# EAGLE design secs_q84 v2 (EAGLE 9.6.2)
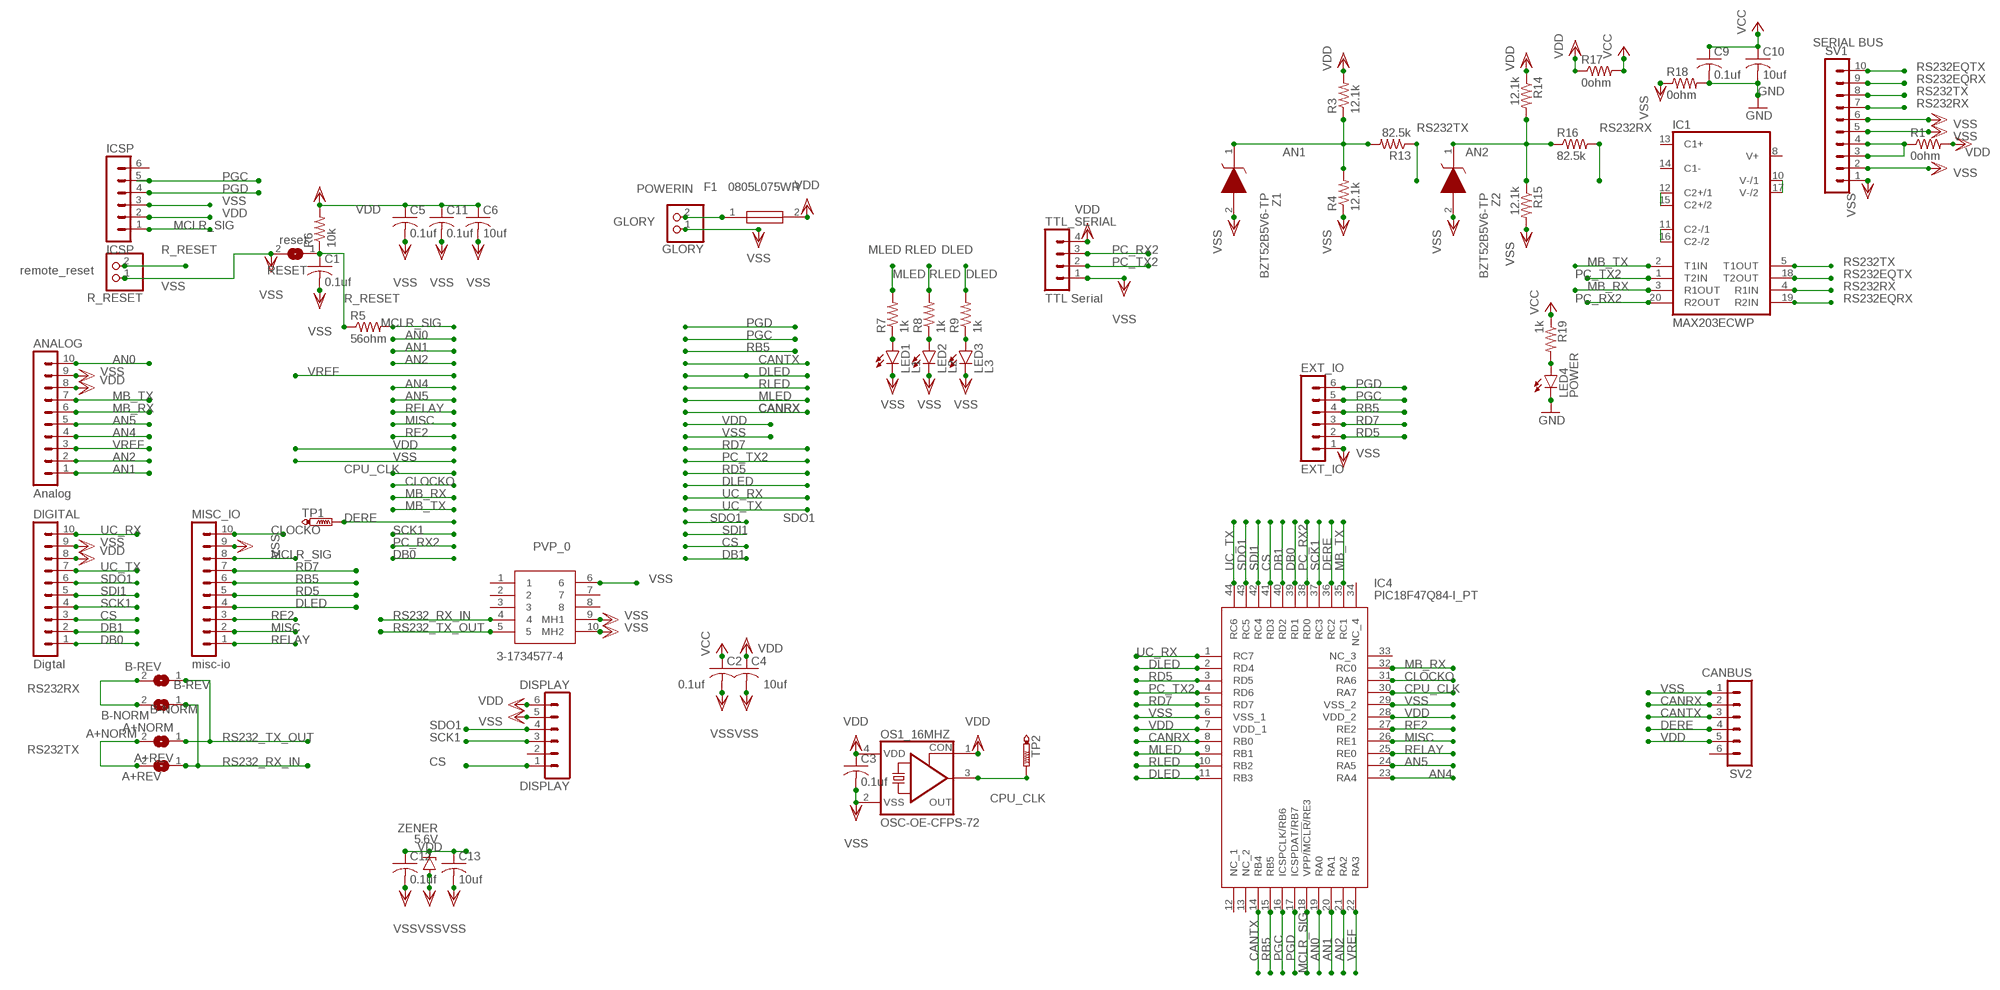
[diagram p0: schematic, sheet 1]

## Parts
A+NORM  A+NORM  SJ  [SJ]
A+REV  A+REV  SJ  [SJ]
ANALOG  Analog  MA10-1  [MA10-1]
B-NORM  B-NORM  SJ  [SJ]
B-REV  B-REV  SJ  [SJ]
C1  0.1uf  C-USC0805  [C0805]
C2  0.1uf  C-USC0805  [C0805]
C3  0.1uf  C-USC0805  [C0805]
C4  10uf  C-USC0805  [C0805]
C5  0.1uf  C-USC0805  [C0805]
C6  10uf  C-USC0805  [C0805]
C9  0.1uf  C-USC0805  [C0805]
C10  10uf  C-USC0805  [C0805]
C11  0.1uf  C-USC0805  [C0805]
C12  0.1uf  C-USC0805  [C0805]
C13  10uf  C-USC0805  [C0805]
DIGITAL  Digtal  MA10-1  [MA10-1]
DISPLAY  DISPLAY  MA06-1  [MA06-1]
EXT_IO  EXT_IO  MA06-1  [MA06-1]
F1  0805L075WR  [FUSC2114X125N]
GLORY  GLORY  PINHD-1X2  [1X02]
IC1  MAX203ECWP  [SO20L]
IC4  PIC18F47Q84-I_PT  [QFP80P1200X1200X120-44N]
ICSP  ICSP  MA06-1  [MA06-1]
LED1  L1  LEDCHIPLED_0805  [CHIPLED_0805]
LED2  L2  LEDCHIPLED_0805  [CHIPLED_0805]
LED3  L3  LEDCHIPLED_0805  [CHIPLED_0805]
LED4  POWER  LEDCHIP-LED0603  [CHIP-LED0603]
MISC_IO  misc-io  MA10-1  [MA10-1]
OS1_16MHZ  OSC-OE-CFPS-72  [7.2X5.2-4-PAD]
PVP_0  3-1734577-4  [317345774]
R1  0ohm  R-US_R0805  [R0805]
R3  12.1k  R-US_R0805  [R0805]
R4  12.1k  R-US_R0805  [R0805]
R5  56ohm  R-US_R0805  [R0805]
R6  10k  R-US_R0805  [R0805]
R7  1k  R-US_R0805  [R0805]
R8  1k  R-US_R0805  [R0805]
R9  1k  R-US_R0805  [R0805]
R13  82.5k  R-US_R0805  [R0805]
R14  12.1k  R-US_R0805  [R0805]
R15  12.1k  R-US_R0805  [R0805]
R16  82.5k  R-US_R0805  [R0805]
R17  0ohm  R-US_R0805  [R0805]
R18  0ohm  R-US_R0805  [R0805]
R19  1k  R-US_R0805  [R0805]
R_RESET  remote_reset  PINHD-1X2  [1X02]
RESET  reset  SJ  [SJ]
SV1  SERIAL BUS  MA10-1  [MA10-1]
SV2  CANBUS  MA06-1  [MA06-1]
TP1  PTR1PAD1-13  [P1-13]
TP2  PTR1PAD1-13  [P1-13]
TTL_SERIAL  TTL Serial  MA04-1  [MA04-1]
Z1  BZT52B5V6-TP  [SOD3716X135N]
Z2  BZT52B5V6-TP  [SOD3716X135N]
ZENER  5.6V  ZENER-DIODESMB  [SMB]

## Nets
AN0: ANALOG.10 IC4.19(RA0)
AN1: ANALOG.1 IC4.20(RA1) R3.1 R4.2 R13.2 Z1.1(K)
AN2: ANALOG.2 IC4.21(RA2) R14.2 R15.1 R16.1 Z2.1(K)
AN4: ANALOG.4 IC4.23(RA4)
AN5: ANALOG.5 IC4.24(RA5)
CANRX: IC4.8(RB0) SV2.2
CANTX: IC4.14(RB4) SV2.3
CLOCKO: IC4.31(RA6) MISC_IO.10
CPU_CLK: IC4.30(RA7) OS1_16MHZ.3(OUT) TP2.TP
CS: DIGITAL.3 DISPLAY.1 IC4.41(RD3)
DB0: DIGITAL.1 IC4.39(RD1)
DB1: DIGITAL.2 IC4.40(RD2)
DERE: IC4.36(RC2) SV2.4 TP1.TP
DLED: IC4.2(RD4) IC4.11(RB3) MISC_IO.4 R9.2
DPOWER [icurrent]: R1.1 SV1.3 SV1.4
GND [icurrent]: C9.2 C10.2 LED4.C R18.2
MB_RX: ANALOG.6 IC1.3(R1OUT) IC4.32(RC0)
MB_TX: ANALOG.7 IC1.2(T1IN) IC4.35(RC1)
MCLR_SIG: IC4.18(VPP/!MCLR!/RE3) ICSP.1 MISC_IO.8 R5.2
MISC: IC4.26(RE1) MISC_IO.2
MLED: IC4.9(RB1) R7.2
N$1: IC1.10(V-/1) IC1.17(V-/2)
N$2: IC1.12(C2+/1) IC1.15(C2+/2)
N$3: LED4.A R19.2
N$4: LED1.A R7.1
N$5: LED2.A R8.1
N$6: LED3.A R9.1
N$7: IC1.11(C2-/1) IC1.16(C2-/2)
PC_RX2: IC1.20(R2OUT) IC4.38(RD0) TTL_SERIAL.3
PC_TX2: IC1.1(T2IN) IC4.4(RD6) TTL_SERIAL.2
PGC: EXT_IO.5 IC4.16(ICSPCLK/RB6) ICSP.5
PGD: EXT_IO.6 IC4.17(ICSPDAT/RB7) ICSP.4
POWERIN [icurrent]: F1.1 GLORY.2
R_RESET: C1.1 R5.1 R6.1 R_RESET.2 RESET.1
RB5: EXT_IO.4 IC4.15(RB5) MISC_IO.6
RD5: EXT_IO.2 IC4.3(RD5) MISC_IO.5
RD7: EXT_IO.3 IC4.5(RD7) MISC_IO.7
RE2: IC4.27(RE2) MISC_IO.3
RELAY: IC4.25(RE0) MISC_IO.1
RLED: IC4.10(RB2) R8.2
RS232_RX_IN: A+REV.1 B-NORM.1 PVP_0.4
RS232_TX_OUT: A+NORM.1 B-REV.1 PVP_0.5
RS232EQRX: IC1.19(R2IN) SV1.9
RS232EQTX: IC1.18(T2OUT) SV1.10
RS232RX: B-NORM.2 B-REV.2 IC1.4(R1IN) R16.2 SV1.7
RS232TX: A+NORM.2 A+REV.2 IC1.5(T1OUT) R13.1 SV1.8
SCK1: DIGITAL.4 DISPLAY.3 IC4.37(RC3)
SDI1: DIGITAL.5 IC4.42(RC4)
SDO1: DIGITAL.6 DISPLAY.4 IC4.43(RC5)
UC_RX: DIGITAL.10 IC4.1(RC7)
UC_TX: DIGITAL.7 IC4.44(RC6)
VCC [icurrent]: C2.1 C9.1 C10.1 R17.2 R19.1
VDD [icurrent]: ANALOG.8 C3.1 C4.1 C5.1 C6.1 C11.1 C12.1 C13.1 DIGITAL.8 DISPLAY.6 F1.2 IC4.7(VDD_1) IC4.28(VDD_2) ICSP.2 OS1_16MHZ.1(CON) OS1_16MHZ.4(VDD) R1.2 R3.2 R6.2 R14.1 R17.1 SV2.5 TTL_SERIAL.4 ZENER.C
VREF: ANALOG.3 IC4.22(RA3)
VSS [icurrent]: ANALOG.9 C1.2 C2.2 C3.2 C4.2 C5.2 C6.2 C11.2 C12.2 C13.2 DIGITAL.9 DISPLAY.5 EXT_IO.1 GLORY.1 IC4.6(VSS_1) IC4.29(VSS_2) ICSP.3 LED1.C LED2.C LED3.C MISC_IO.9 OS1_16MHZ.2(VSS) PVP_0.6 PVP_0.9(MH1) PVP_0.10(MH2) R4.1 R15.2 R18.1 R_RESET.1 RESET.2 SV1.1 SV1.2 SV1.5 SV1.6 SV2.1 TTL_SERIAL.1 Z1.2(A) Z2.2(A) ZENER.A
Unconnected: DISPLAY.2 IC1.8(V+) IC1.13(C1+) IC1.14(C1-) IC4.12(NC_1) IC4.13(NC_2) IC4.33(NC_3) IC4.34(NC_4) ICSP.6 PVP_0.1 PVP_0.2 PVP_0.3 PVP_0.7 PVP_0.8 SV2.6

## Power pins joined to a net without a drawn wire
GND: IC1.6(GND) IC1.9(GND)
VCC: IC1.7(VCC)

## Library data of the parts
A+NORM A+REV B-NORM B-REV RESET = jumper:SJ: SMD solder JUMPER
ANALOG DIGITAL MISC_IO SV1 = con-lstb:MA10-1: PIN HEADER; OC_FARNELL: unknown; OC_NEWARK: unknown
C1-C6 C9-C13 = rcl:C-US: CAPACITOR, American symbol; SPICEPREFIX: C
DISPLAY EXT_IO ICSP SV2 = con-lstb:MA06-1: PIN HEADER; OC_FARNELL: unknown; OC_NEWARK: unknown
F1 = 0805L075WR:0805L075WR: PTC Resettable Fuse 0.75A(hold) 1.5A(trip) 6VDC 40A 0.6W 0.2s 0.09Ohm SMD Solder Pad 0805 T/R Source: Datasheet <https://www.arrow.com/en/products/0805l075wr/littelfuse>; DESCRIPTION: PTC Resettable Fuse 0.75A(hold) 1.5A(trip) 6VDC 40A 0.6W 0.2s 0.09Ohm SMD Solder Pad 0805 T/R; HEIGHT: 1.25mm; MANUFACTURER_NAME: LITTELFUSE; MANUFACTURER_PART_NUMBER: 0805L075WR; MOUSER_PART_NUMBER: 576-0805L075WR; MOUSER_PRICE-STOCK: https://www.mouser.co.uk/ProductDetail/Littelfuse/0805L075WR?qs=gOdenYySUw5wkBcmg2CY4A%3D%3D
GLORY R_RESET = pinhead:PINHD-1X2: PIN HEADER
IC1 = maxim:MAX203ECWP: RS232 TRANSCEIVER; MPN: MAX203ECWP+G36; OC_FARNELL: 1224204; OC_NEWARK: 89K3435
IC4 = PIC18F47Q84-I_PT:PIC18F47Q84-I_PT: 8-bit Microcontrollers - MCU CAN-FD, 128KB Flash, 13KB RAM, 12b ADC3, UTMR, DAC, Comp, PWM, CCP, CWG, HLT, WWDT, SCAN/CRC, ZCD, PPS,Comms IDLE/DOZE/PMD, JTAG Source: Datasheet <https://ww1.microchip.com/downloads/en/DeviceDoc/PIC18F27-47-57Q84-Data-Sheet-40002213D.pdf>; DESCRIPTION: 8-bit Microcontrollers - MCU CAN-FD, 128KB Flash, 13KB RAM, 12b ADC3, UTMR, DAC, Comp, PWM, CCP, CWG, HLT, WWDT, SCAN/CRC, ZCD, PPS,Comms IDLE/DOZE/PMD, JTAG; HEIGHT: 1.2mm; MANUFACTURER_NAME: Microchip; MANUFACTURER_PART_NUMBER: PIC18F47Q84-I/PT; MOUSER_PART_NUMBER: 579-PIC18F47Q84-I/PT; MOUSER_PRICE-STOCK: https://www.mouser.co.uk/ProductDetail/Microchip-Technology/PIC18F47Q84-I-PT?qs=d0WKAl%252BL4KYthTnAmf%2FYSg%3D%3D
LED1-LED4 = led:LED: LED OSRAM: - CHIPLED LG R971, LG N971, LY N971, LG Q971, LY Q971, LO R971, LY R971 LH N974, LH R974 LS Q976, LO Q976, LY Q976 LO Q996 - Hyper CHIPLED LW Q18S LB Q993, LB Q99A, LB R99A - SideLED LS A670, LO A670, LY A670, LG A670, LP A670 LB A673, LV A673, LT A673, LW A673 LH A674 LY A675 LS A676, LA A676, LO A676, LY A676, LW A676 LS A679, LY A679, LG A679 - Hyper Micro SIDELED® LS Y876, LA Y876, LO Y876, LY Y876 LT Y87S - SmartLED LW L88C, LW L88S LB L89C, LB L89S, LG L890 LS L89K, LO L89K, LY L89K LS L896, LA L896, LO L896, LY L896 - TOPLED LS T670, LO T670, LY T670, LG T670, LP T670 LSG T670, LSP T670, LSY T670, LOP T670, LYG T670 LG T671, LOG T671, LSG T671 LB T673, LV T673, LT T673, LW T673 LH T674 LS T676, LA T676, LO T676, LY T676, LB T676, LH T676, LSB T676, LW T676 LB T67C, LV T67C, LT T67C, LS T67K, LO T67K, LY T67K, LW E67C LS E67B, LA E67B, LO E67B, LY E67B, LB E67C, LV E67C, LT E67C LW T67C LS T679, LY T679, LG T679 LS T770, LO T770, LY T770, LG T770, LP T770 LB T773, LV T773, LT T773, LW T773 LH T774 LS E675, LA E675, LY E675, LS T675 LS T776, LA T776, LO T776, LY T776, LB T776 LHGB T686 LT T68C, LB T68C - Hyper Mini TOPLED® LB M676 - Mini TOPLED Santana® LG M470 LS M47K, LO M47K, LY M47K Source: http://www.osram.convergy.de LUXEON: - LUMILED® LXK2-PW12-R00, LXK2-PW12-S00, LXK2-PW14-U00, LXK2-PW14-V00 LXK2-PM12-R00, LXK2-PM12-S00, LXK2-PM14-U00 LXK2-PE12-Q00, LXK2-PE12-R00, LXK2-PE12-S00, LXK2-PE14-T00, LXK2-PE14-U00 LXK2-PB12-K00, LXK2-PB12-L00, LXK2-PB12-M00, LXK2-PB14-N00, LXK2-PB14-P00, LXK2-PB14-Q00 LXK2-PR12-L00, LXK2-PR12-M00, LXK2-PR14-Q00, LXK2-PR14-R00 LXK2-PD12-Q00, LXK2-PD12-R00, LXK2-PD12-S00 LXK2-PH12-R00, LXK2-PH12-S00 LXK2-PL12-P00, LXK2-PL12-Q00, LXK2-PL12-R00 Source: www.luxeon.com KINGBRIGHT: KA-3528ASYC Source: www.kingbright.com
OS1_16MHZ = IQD-Frequency-Products:OSC-OE: OSCILLATOR WITH OE
PVP_0 = 3-1734577-4:3-1734577-4: RJ45 Connector, Single Port, 1 x 1, Standard Connector Contact Density, Jack, Shielded, Cat 3, Standard - Latch Down, 8 Position, Standard Profile Source: Datasheet <https://www.te.com/commerce/DocumentDelivery/DDEController?Action=showdoc&DocId=Customer Drawing1734577D1pdfEnglishENG_CD_1734577_D1.pdf3-1734577-4>; DESCRIPTION: RJ45 Connector, Single Port, 1 x 1, Standard Connector Contact Density, Jack, Shielded, Cat 3, Standard - Latch Down, 8 Position, Standard Profile; HEIGHT: 16.8mm; MANUFACTURER_NAME: TE Connectivity; MANUFACTURER_PART_NUMBER: 3-1734577-4; MOUSER_PART_NUMBER: 571-3-1734577-4; MOUSER_PRICE-STOCK: https://www.mouser.co.uk/ProductDetail/TE-Connectivity-AMP/3-1734577-4?qs=Z4JOKa0a9TUSCOA052xCCw%3D%3D
R1 R3-R9 R13-R19 = rcl:R-US_: RESISTOR, American symbol; SPICEPREFIX: R
TP1 TP2 = testpad:PTR1: TEST PIN
TTL_SERIAL = con-lstb:MA04-1: PIN HEADER; OC_FARNELL: unknown; OC_NEWARK: unknown
Z1 Z2 = BZT52B5V6-TP:BZT52B5V6-TP: Zener Diodes Source: Datasheet <https://componentsearchengine.com/Datasheets/1/BZT52B5V6-TP.pdf>; DESCRIPTION: Zener Diodes; HEIGHT: 1.35mm; MANUFACTURER_NAME: MCC; MANUFACTURER_PART_NUMBER: BZT52B5V6-TP; MOUSER_PART_NUMBER: 833-BZT52B5V6-TP; MOUSER_PRICE-STOCK: https://www.mouser.com/Search/Refine.aspx?Keyword=833-BZT52B5V6-TP
ZENER = diode:ZENER-DIODE: Z-Diode

## Net classes
1 icurrent: width 0.305 mm

## Board
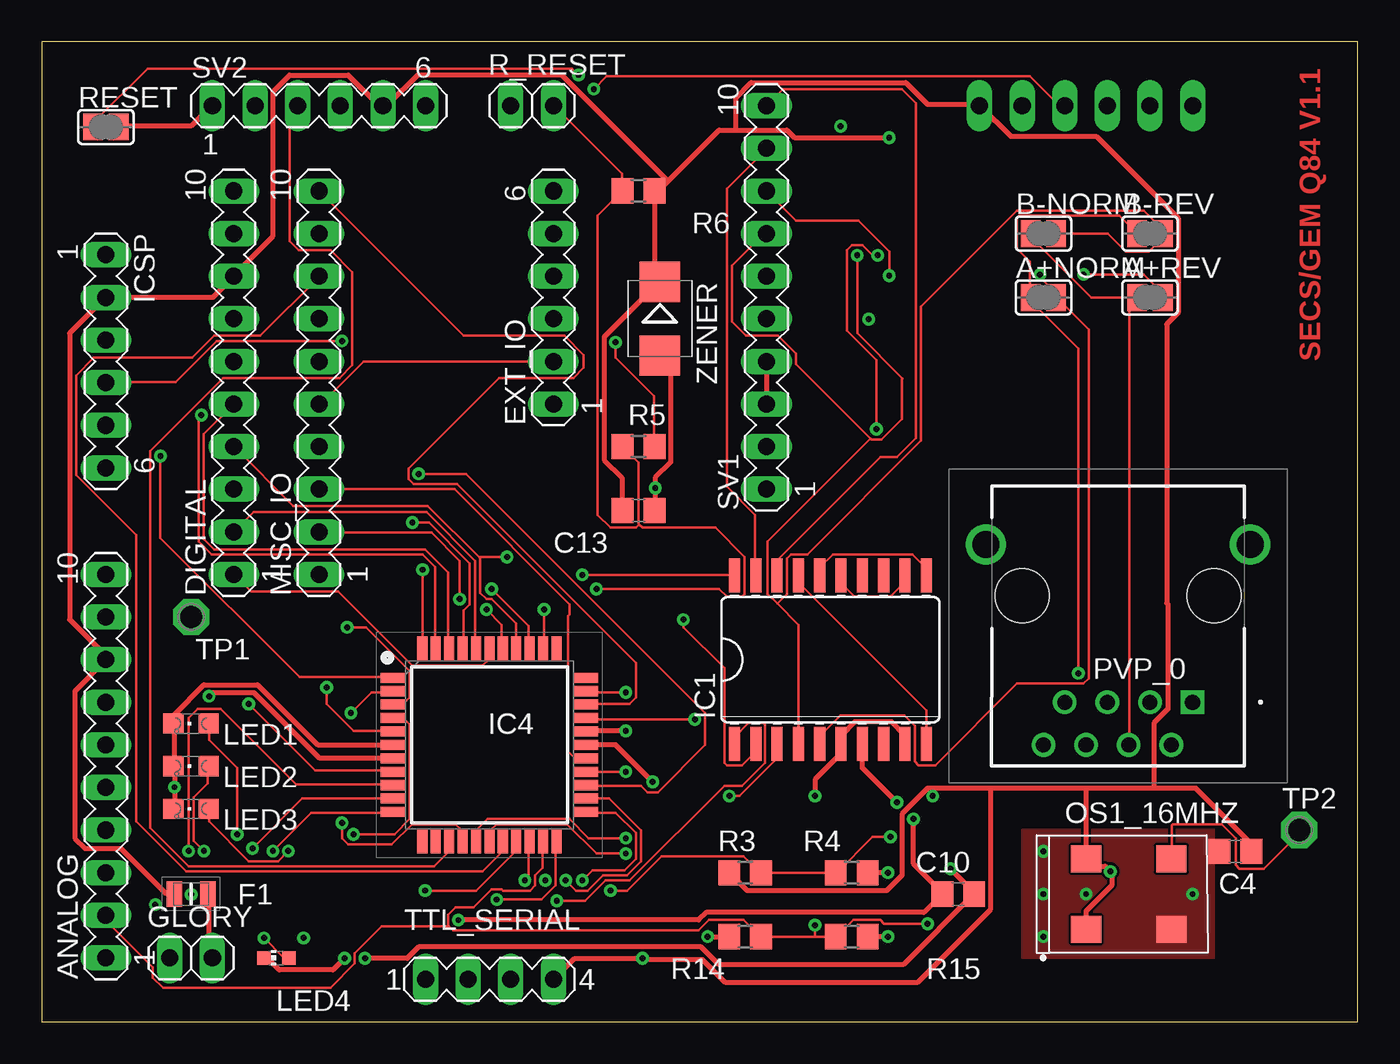
[diagram p1: board, top side]
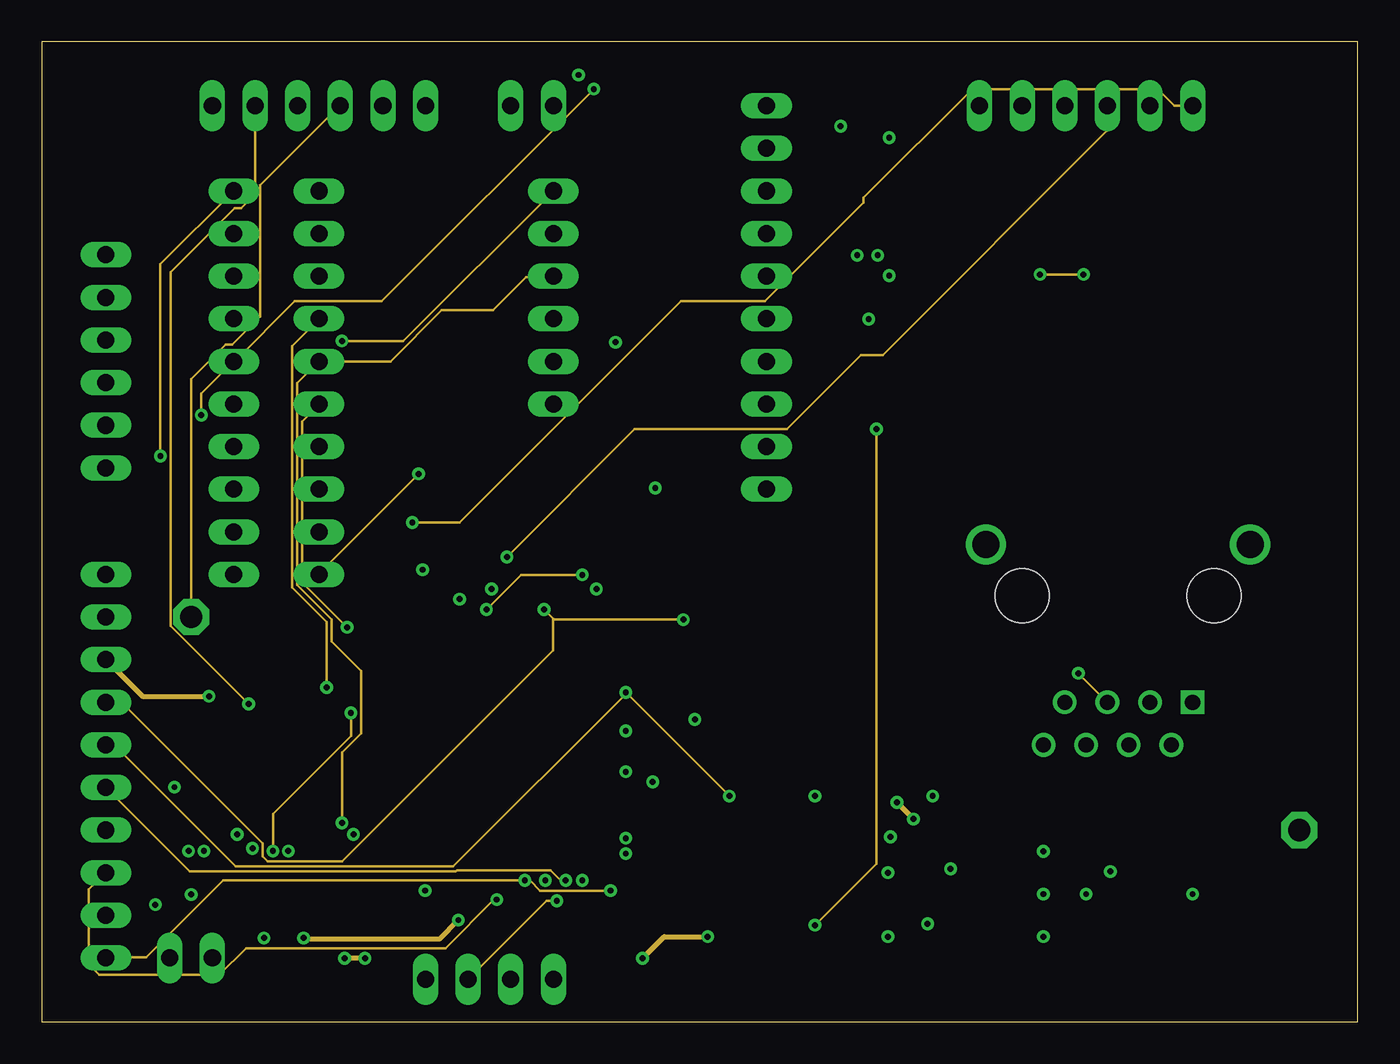
[diagram p2: board, inner layer Route2]
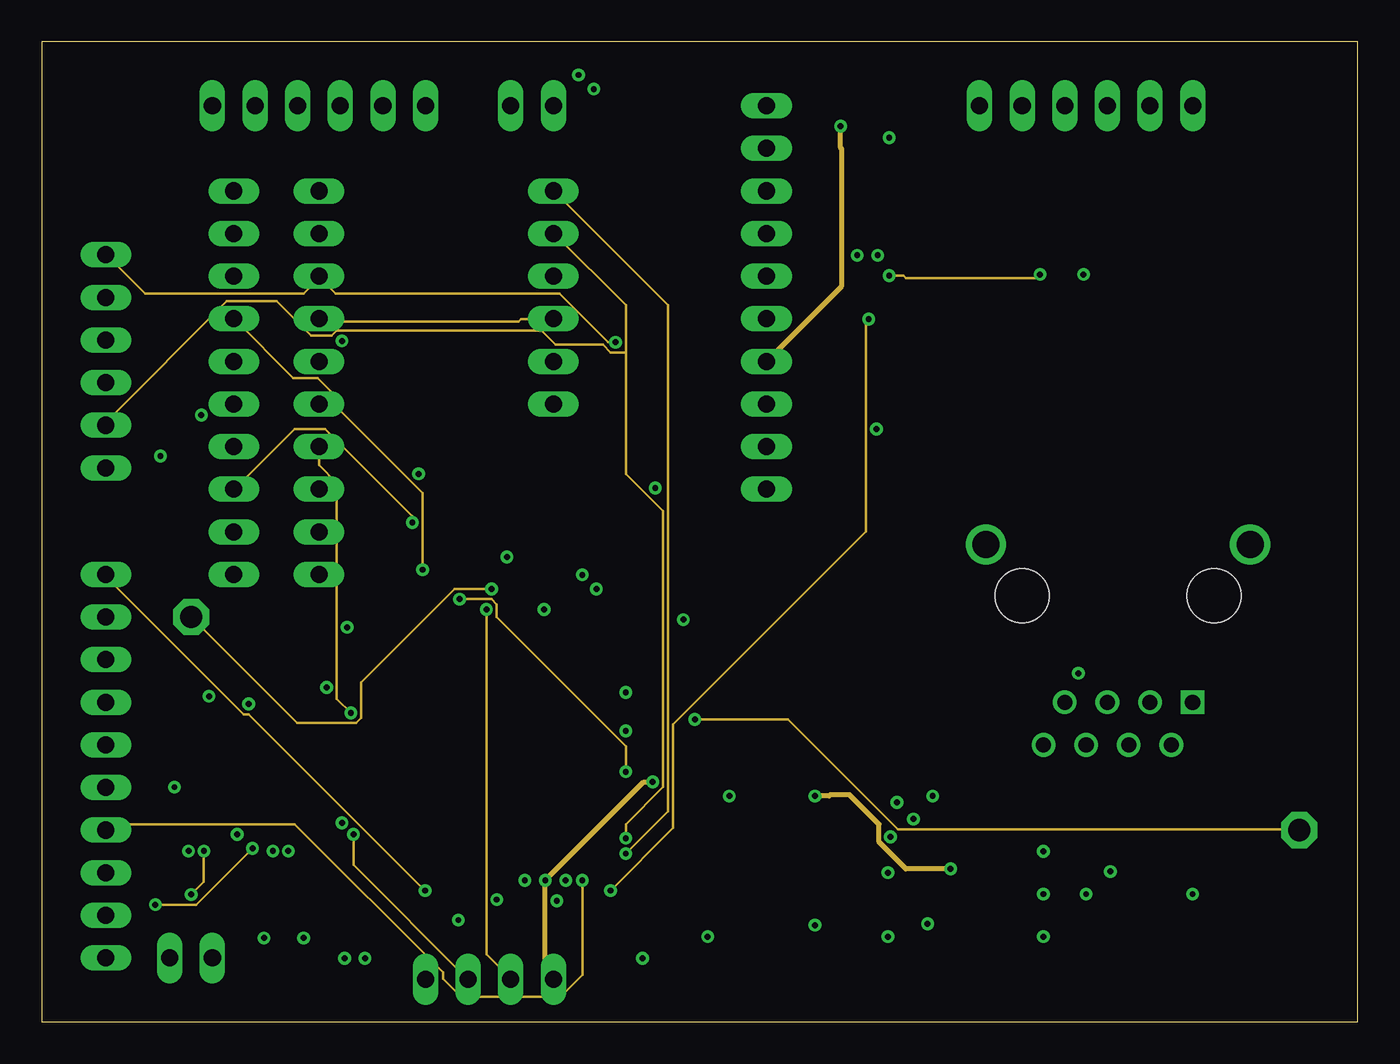
[diagram p3: board, inner layer Route15]
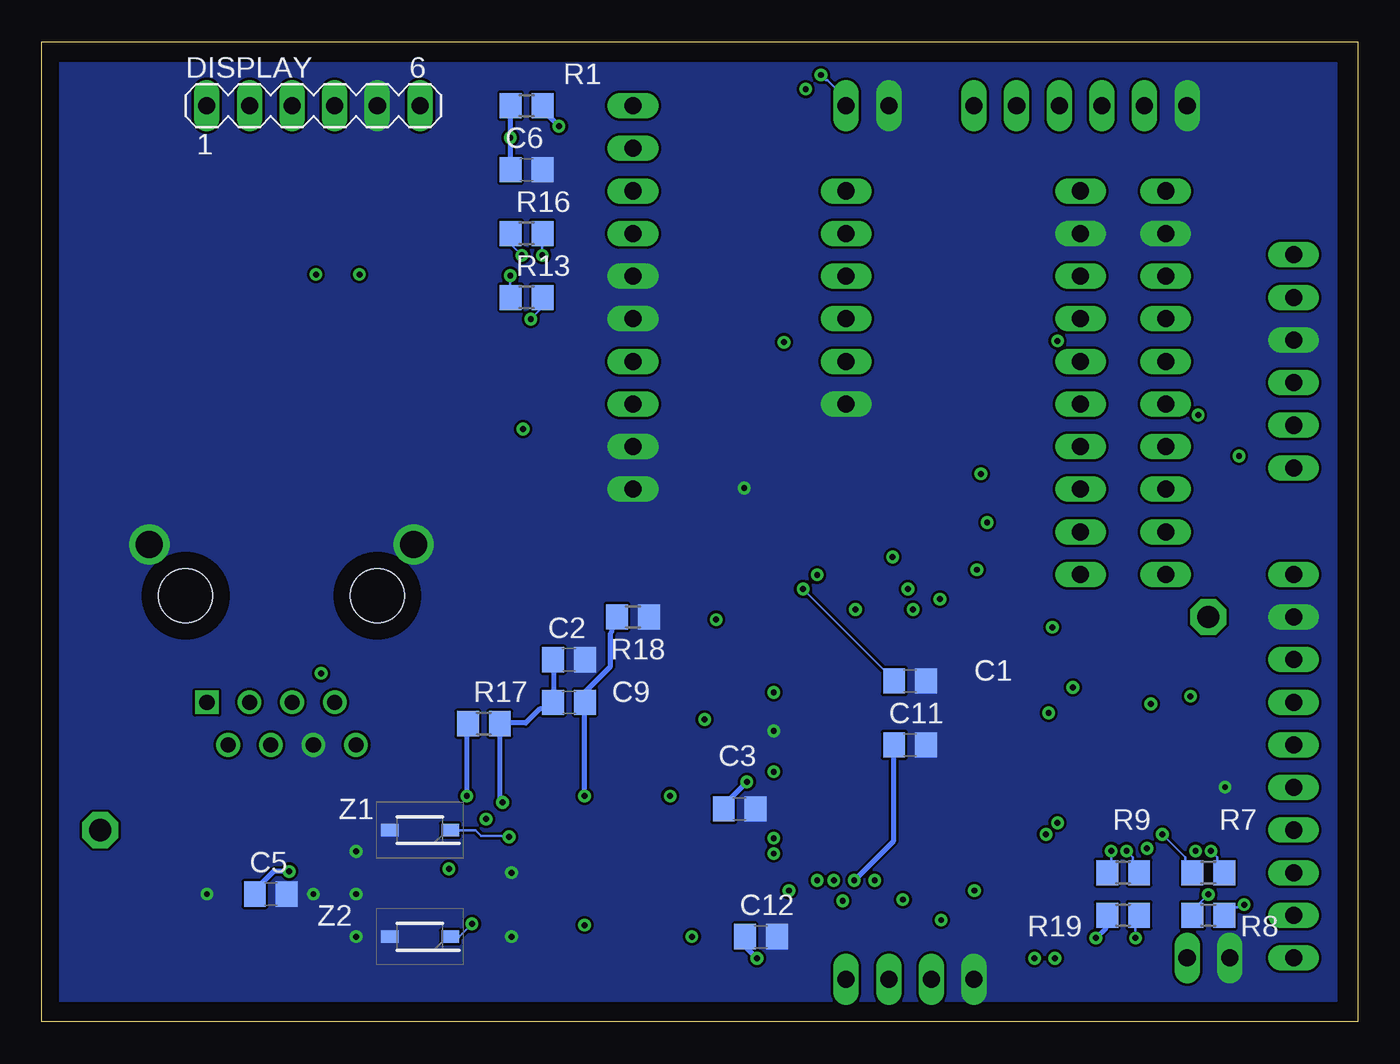
[diagram p4: board, bottom side, seen from below]

Size 78.41 x 58.41 mm. Coordinates in mm from the lower left corner, seen from the top.
Outline: 0,0 78.41,0 78.41,58.41 0,58.41 0,0
Copper layers (1+2*15+16): Top 0.035mm / dielectric 1.5mm / Route2 0.035mm / dielectric 0.15mm / Route15 0.035mm / dielectric 0.2mm / Bottom 0.035mm
Design rules "default *": minimum track width 6mil, minimum drill 0.35mm, track to track 6mil, track to pad 6mil, pad to pad 6mil, via to via 6mil, smd to smd 6mil, copper to edge 40mil, drill to drill 6mil, minimum pad ring 10mil, minimum via ring 8mil, stop-mask expansion 4mil, vias tented up to drill 0mil, thermal gap 10mil
tRestrict: area 22.9,12.7 to 30.5,20.3
vRestrict: area 19.1,8.9 to 34.3,24.1; area 52.1,27.9 to 76.2,34.3; area 39.4,14 to 57.1,29.2

### Footprints (pad centres in the part's own frame; a part is rotated, then mirrored left to right if it is on the bottom)
SJ = smd 1.168 x 1.6: 1 -0.762,0; 2 0.762,0
MA10-1 = drill 1.016 long: 1 -11.43,0; 2 -8.89,0; 3 -6.35,0; 4 -3.81,0; 5 -1.27,0; 6 1.27,0; 7 3.81,0; 8 6.35,0; 9 8.89,0; 10 11.43,0
C0805 = smd 1.3 x 1.5: 1 -0.95,0; 2 0.95,0
MA06-1 = drill 1.016 long: 1 -6.35,0; 2 -3.81,0; 3 -1.27,0; 4 1.27,0; 5 3.81,0; 6 6.35,0
FUSC2114X125N = smd 0.93 x 1.52: 1 -1,0; 2 1,0
1X02 = drill 1.016 long: 1 -1.27,0; 2 1.27,0
SO20L = smd 0.66 x 2.032: 1 -5.715,-5.029; 2 -4.445,-5.029; 3 -3.175,-5.029; 4 -1.905,-5.029; 5 -0.635,-5.029; 6 0.635,-5.029; 7 1.905,-5.029; 8 3.175,-5.029; 9 4.445,-5.029; 10 5.715,-5.029; 11 5.715,5.029; 12 4.445,5.029; 13 3.175,5.029; 14 1.905,5.029; 15 0.635,5.029; 16 -0.635,5.029; 17 -1.905,5.029; 18 -3.175,5.029; 19 -4.445,5.029; 20 -5.715,5.029
QFP80P1200X1200X120-44N = smd 1.475 x 0.6: 1 -5.738,4; 2 -5.738,3.2; 3 -5.738,2.4; 4 -5.738,1.6; 5 -5.738,0.8; 6 -5.738,0; 7 -5.738,-0.8; 8 -5.738,-1.6; 9 -5.738,-2.4; 10 -5.738,-3.2; 11 -5.738,-4; 23 5.738,-4; 24 5.738,-3.2; 25 5.738,-2.4; 26 5.738,-1.6; 27 5.738,-0.8; 28 5.738,0; 29 5.738,0.8; 30 5.738,1.6; 31 5.738,2.4; 32 5.738,3.2; 33 5.738,4 | smd 0.6 x 1.475: 12 -4,-5.738; 13 -3.2,-5.738; 14 -2.4,-5.738; 15 -1.6,-5.738; 16 -0.8,-5.738; 17 0,-5.738; 18 0.8,-5.738; 19 1.6,-5.738; 20 2.4,-5.738; 21 3.2,-5.738; 22 4,-5.738; 34 4,5.738; 35 3.2,5.738; 36 2.4,5.738; 37 1.6,5.738; 38 0.8,5.738; 39 0,5.738; 40 -0.8,5.738; 41 -1.6,5.738; 42 -2.4,5.738; 43 -3.2,5.738; 44 -4,5.738
CHIPLED_0805 = smd 1.2 x 1.2: A 0,-1.05; C 0,1.05
CHIP-LED0603 = smd 0.8 x 0.8: A 0,-0.75; C 0,0.75
7.2X5.2-4-PAD = smd 1.8 x 1.6: 1 -2.54,-2.1; 2 2.54,-2.1; 3 2.54,2.1; 4 -2.54,2.1
317345774 = drill 0.9 pad 1.4 square: 1 0,0 | drill 0.9 pad 1.4: 2 -1.27,-2.54; 3 -2.54,0; 4 -3.81,-2.54; 5 -5.08,0; 6 -6.35,-2.54; 7 -7.62,0; 8 -8.89,-2.54 | drill 1.6 pad 2.4: 9 3.43,9.4; 10 -12.32,9.4 | hole 3.2: 1.27,6.35; -10.16,6.35
R0805 = smd 1.3 x 1.5: 1 -0.95,0; 2 0.95,0
P1-13 = drill 1.321 pad 2.159 octagon: TP 0,0
MA04-1 = drill 1.016 long: 1 -3.81,0; 2 -1.27,0; 3 1.27,0; 4 3.81,0
SOD3716X135N = smd 1.05 x 0.75: 1 -1.8,0; 2 1.8,0
SMB = smd 2.4 x 2.4: A 2.2,0; C -2.2,0

### Placement (x,y rotation side)
A+NORM  59.69,43.18 0 top
A+REV  66.04,43.18 0 top
ANALOG  3.81,15.24 90 top
B-NORM  59.69,46.99 0 top
B-REV  66.04,46.99 0 top
C1  26.67,20.32 0 bottom
C2  46.99,21.59 0 bottom
C3  36.83,12.7 0 bottom
C4  71.12,10.16 180 top
C5  64.77,7.62 0 bottom
C6  49.53,50.8 0 bottom
C9  46.99,19.05 0 bottom
C10  54.61,7.62 0 top
C11  26.67,16.51 0 bottom
C12  35.56,5.08 0 bottom
C13  35.56,30.48 0 top
DIGITAL  11.43,38.1 90 top
DISPLAY  62.23,54.61 0 bottom
EXT_IO  30.48,43.18 90 top
F1  8.89,7.62 180 top
GLORY  8.89,3.81 0 top
IC1  46.99,21.59 0 top
IC4  26.67,16.51 0 top
ICSP  3.81,39.37 270 top
LED1  8.89,17.78 90 top
LED2  8.89,15.24 90 top
LED3  8.89,12.7 90 top
LED4  13.97,3.81 90 top
MISC_IO  16.51,38.1 90 top
OS1_16MHZ  64.77,7.62 0 top
PVP_0  68.58,19.05 0 top
R1  49.53,54.61 180 bottom
R3  41.91,8.89 180 top
R4  48.26,8.89 180 top
R5  35.56,34.29 0 top
R6  35.56,49.53 0 top
R7  8.89,8.89 0 bottom
R8  8.89,6.35 0 bottom
R9  13.97,8.89 0 bottom
R13  49.53,43.18 0 bottom
R14  41.91,5.08 0 top
R15  48.26,5.08 0 top
R16  49.53,46.99 0 bottom
R17  52.07,17.78 0 bottom
R18  43.18,24.13 180 bottom
R19  13.97,6.35 0 bottom
R_RESET  29.21,54.61 0 top
RESET  3.81,53.34 0 top
SV1  43.18,43.18 90 top
SV2  16.51,54.61 0 top
TP1  8.89,24.13 0 top
TP2  74.93,11.43 0 top
TTL_SERIAL  26.67,2.54 0 top
Z1  55.88,11.43 180 bottom
Z2  55.88,5.08 180 bottom
ZENER  36.83,41.91 270 top

### Tracks (layer width: path | path; a pad name or v marks a point on that pad's centre or on a via)
AN0  (via drill 0.35)
  Top 0.152: v22.83,7.82 25.88,7.82 28.25,10.18 28.25,10.72 IC4.19
  Route15 0.152: v22.83,7.82 12.32,18.34 12.01,18.34 3.86,26.49 3.86,26.64 ANALOG.10
AN1  (via drill 0.35)
  Top 0.152: v28.78,8.43 29.01,8.66 29.01,10.72 IC4.20 | v50.57,11.02 49.5,11.02 47.37,8.89 R4.2 R3.1 42.8,8.89 41.81,9.88 36.93,9.88 34.87,7.82 v33.88,7.82
  Route2 0.152: v33.88,7.82 29.69,7.82 29.08,8.43 v28.78,8.43 10.79,8.43 6.22,3.86 3.86,3.86 ANALOG.1
  Route15 0.152: v33.88,7.82 37.62,11.56 37.62,17.73 49.12,29.24 49.12,41.89 49.2,41.96 v49.28,41.89
  Bottom 0.152: v49.28,41.89 48.59,42.57 R13.2 | 53.92,11.4 54.08,11.4 Z1.1 53.92,11.4 | 53.92,11.4 52.55,11.4 52.25,11.1 51.03,11.1 50.88,10.95 50.65,10.95 v50.57,11.02
AN2  (via drill 0.35)
  Top 0.152: 24.24,5.73 24.51,5.46 39.14,5.46 39.75,6.07 41.81,6.07 42.8,5.08 R14.2 46.08,5.08 | 24.24,5.73 24.21,5.77 24.21,6.38 24.66,6.83 25.73,6.83 26.8,7.9 27.41,7.9 27.48,7.82 29.08,7.82 29.39,8.13 29.39,8.74 29.85,9.2 29.85,10.72 IC4.21 | 46.08,5.08 R15.1 47.37,5.08 48.36,6.07 49.96,6.07 50.19,5.84 v52.78,5.84 | v49.73,35.33 49.73,39.45 47.98,41.2 47.98,46 48.28,46.3 48.89,46.3 49.5,45.69 v49.81,45.69 | 46.08,5.08 v46.08,5.77 | ANALOG.2 3.86,6.3 3.86,5.99 6.6,3.25 6.6,2.64 7.21,2.03 17.2,2.03 18.64,3.48 18.64,4.09 20.24,5.69 24.21,5.69 24.24,5.73
  Route2 0.152: v49.73,35.33 49.73,9.42 v46.08,5.77
  Bottom 0.152: v49.81,45.69 50.42,46.3 50.42,46.99 R16.1 | Z2.1 53.54,5.08 v52.78,5.84
AN4  (via drill 0.35)
  Top 0.152: v32.21,8.43 32.82,9.04 34.72,9.04 35.41,9.73 35.41,11.25 34.19,12.47 32.44,12.47 IC4.23
  Route15 0.152: v32.21,8.43 32.21,2.79 30.91,1.5 24.97,1.5 23.9,2.57 23.9,2.95 15.06,11.79 4.17,11.79 ANALOG.4
AN5  (via drill 0.35)
  Top 0.152: v31.22,8.43 31.83,7.82 32.51,7.82 33.43,8.74 34.87,8.74 35.71,9.58 35.71,11.4 33.81,13.31 32.44,13.31 IC4.24
  Route2 0.152: v31.22,8.43 30.91,8.43 30.3,9.04 24.74,9.04 24.66,8.97 8.81,8.97 ANALOG.5
CANRX  (via drill 0.35)
  Top 0.152: v12.32,18.95 16.28,14.99 20.93,14.99 IC4.8
  Route2 0.152: v12.32,18.95 7.67,23.6 7.67,44.7 11.48,48.51 11.86,48.51 12.7,49.35 SV2.2
CANTX
  Top 0.152: IC4.14 24.21,10.72 24.21,10.11 23.37,9.27 8.74,9.27 6.45,11.56 6.45,34.04 10.79,38.38 17.73,38.38 18.49,39.14 18.49,44.7 17.2,46 15.29,46 14.76,46.53 14.76,54.15 15.21,54.61 SV2.3
CLOCKO
  Top 0.152: IC4.31 32.44,18.95 35.03,18.95 35.41,19.33 35.41,21.39 24.74,32.06 22.15,32.06 21.84,32.36 21.84,32.97 27.25,38.38 31.67,38.38 32.28,38.99 32.28,39.75 31.14,40.89 25.12,40.89 16.51,49.5 MISC_IO.10
CPU_CLK  (via drill 0.35)
  Top 0.152: v38.91,18.03 32.44,18.03 IC4.30 | OS1_16MHZ.3 67.33,9.73 67.33,11.71 67.41,11.79 70.31,11.79 71.14,10.95 71.14,9.35 71.37,9.12 72.82,9.12 74.88,11.18 74.88,11.4 TP2.TP
  Route15 0.152: TP2.TP 74.88,11.48 51.03,11.48 44.47,18.03 v38.91,18.03
CS  (via drill 0.35)
  Top 0.152: v22.07,29.77 23.06,29.77 25.5,27.33 25.5,24.89 25.12,24.51 25.12,22.3 IC4.41
  Route2 0.152: v22.07,29.77 24.89,29.77 38.08,42.95 43.1,42.95 48.97,48.82 48.97,49.12 55.45,55.6 66.5,55.6 67.49,54.61 DISPLAY.1
  Route15 0.152: v22.07,29.77 22.07,30.15 16.89,35.33 15.06,35.33 11.48,31.75 DIGITAL.3
DB0
  Top 0.152: IC4.39 26.64,22.22 26.64,21.61 26.26,21.23 22.07,21.23 17.65,25.65 12.47,25.65 11.48,26.64 DIGITAL.1
DB1
  Top 0.152: IC4.40 25.81,22.3 25.81,27.48 22.91,30.38 12.62,30.38 11.48,29.24 DIGITAL.2
DERE  (via drill 0.35)
  Top 0.152: v26.8,25.81 29.01,23.6 29.01,22.3 IC4.36
  Route2 0.152: TP1.TP 8.89,38.3 10.95,40.36 11.33,40.36 13,42.04 13,49.89 17.73,54.61 SV2.4
  Route15 0.152: v26.8,25.81 24.59,25.81 19.03,20.24 19.03,18.11 18.72,17.81 15.21,17.81 TP1.TP
DLED  (via drill 0.35)
  Top 0.152: v13.77,10.18 16.05,12.47 20.93,12.47 IC4.11 | v18.42,18.42 19.63,19.63 20.93,19.63 IC4.2
  Route2 0.152: v18.42,18.42 18.42,17.04 13.77,12.39 v13.77,10.18
  Route15 0.152: MISC_IO.4 16.51,33.2 17.58,32.13 17.58,19.25 v18.42,18.42
  Bottom 0.152: v13.77,10.18 13.39,9.8 13.39,9.2 13.08,8.89 R9.2
DPOWER  (via drill 0.35)
  Top 0.305: SV1.4 SV1.3
  Route15 0.305: v47.6,53.39 47.6,52.09 47.68,52.02 47.68,43.87 SV1.4
  Bottom 0.305: v47.6,53.39 48.51,54.3 48.51,54.61 R1.1
GND  (via drill 0.35)
  Top 0.305: IC1.9 51.41,16.59 51.41,17.12 50.65,17.88 48.44,17.88 47.68,17.12 47.68,16.59 IC1.6 47.6,16.43 47.6,15.98 46.08,14.45 v46.08,13.46 | v19.25,3.79 21.77,3.79 22.45,4.47 39.29,4.47 40.36,3.4 51.33,3.4 55.52,7.59 C10.2 54.99,8.28 v54.15,9.12 | v18.03,3.79 17.35,3.1 14.15,3.1 13.46,3.79 13.23,3.79 LED4.C
  Route2 0.305: v19.25,3.79 v18.03,3.79
  Route15 0.305: v46.08,13.46 46.91,13.46 46.99,13.54 48.13,13.54 49.89,11.79 49.89,10.72 51.49,9.12 v54.15,9.12
  Bottom 0.305: R18.2 44.17,24.13 44.47,23.82 44.47,23.22 44.55,23.14 44.55,21.16 46,19.71 46,19.1 C9.2 46.08,18.95 v46.08,13.46
MB_RX  (via drill 0.35)
  Top 0.152: v34.8,19.63 32.44,19.63 IC4.32 | v40.97,13.46 41.58,13.46 43.79,15.67 43.79,16.51 IC1.3
  Route2 0.152: v40.97,13.46 v34.8,19.63 34.8,19.56 24.51,9.27 11.56,9.27 4.32,16.51 ANALOG.6
MB_TX  (via drill 0.35)
  Top 0.152: v29.92,24.59 29.92,22.3 IC4.35 | v38.23,23.98 38.23,23.52 40.67,21.08 40.67,15.44 40.82,15.29 41.73,15.29 42.49,16.05 42.49,16.51 IC1.2
  Route2 0.152: 30.49,24.02 30.53,23.98 v38.23,23.98 | 30.49,24.02 v29.92,24.59 | ANALOG.7 3.86,19.03 4.77,19.03 13.16,10.64 13.16,9.88 13.46,9.58 17.88,9.58 30.46,22.15 30.46,23.98 30.49,24.02
MCLR_SIG  (via drill 0.35)
  Top 0.152: IC4.18 27.41,10.72 27.41,10.11 26.26,8.97 8.59,8.97 5.61,11.94 5.61,29.01 2.03,32.59 2.03,38.53 3.1,39.6 8.97,39.6 10.26,40.89 13,40.89 16.51,44.4 MISC_IO.8 | v34.19,40.51 34.19,39.6 36.47,37.31 36.47,34.34 R5.2
  Route15 0.152: v34.19,40.51 33.73,40.51 30.84,43.41 17.5,43.41 16.51,44.4 MISC_IO.8 16.51,44.32 15.6,43.41 6.15,43.41 3.86,45.69 ICSP.1
MISC  (via drill 0.35)
  Top 0.152: v34.8,14.91 32.44,14.91 IC4.26 | v24.89,25.2 24.89,27.48 23.22,29.16 16.51,29.16 MISC_IO.2
  Route15 0.152: v34.8,14.91 34.8,16.43 27.1,24.13 27.1,24.89 26.8,25.2 v24.89,25.2
MLED  (via drill 0.35)
  Top 0.152: v8.74,10.18 8.74,18.11 9.27,18.64 10.64,18.64 15.14,14.15 20.93,14.15 IC4.9
  Bottom 0.152: v8.74,10.18 8.36,9.8 8.36,9.27 7.98,8.89 R7.2
N$1
  Top 0.152: IC1.10 52.7,18.57 45.08,26.19 IC1.17
N$2
  Top 0.152: IC1.15 47.68,26.57 47.68,26.11 48.44,25.35 50.57,25.35 51.41,26.19 51.41,26.57 IC1.12
N$3  (via drill 0.35)
  Top 0.152: v13.23,5 14.38,3.86 14.68,3.86 LED4.A
  Bottom 0.152: v13.23,5 13.23,6.15 13.08,6.3 R19.2
N$4  (via drill 0.35)
  Top 0.152: v11.63,11.18 11.63,15.14 9.96,16.82 9.96,17.73 LED1.A
  Bottom 0.152: v11.63,11.18 10.26,9.8 10.26,9.27 9.88,8.89 R7.1
N$5  (via drill 0.35)
  Top 0.152: v9.65,10.18 9.04,10.79 9.04,13.39 9.88,14.22 9.88,15.21 LED2.A
  Route15 0.152: v9.65,10.18 9.65,8.36 v8.89,7.59
  Bottom 0.152: v8.89,7.59 9.8,6.68 9.8,6.38 R8.1
N$6  (via drill 0.35)
  Top 0.152: v14.68,10.18 14.07,9.58 12.32,9.58 9.96,11.94 9.96,12.7 LED3.A
  Bottom 0.152: v14.68,10.18 14.68,9.12 R9.1
N$7
  Top 0.152: IC1.11 52.7,27.03 51.87,27.86 47.14,27.86 46.38,27.1 46.38,26.64 IC1.16
PC_RX2  (via drill 0.35)
  Top 0.152: v26.49,24.59 27.41,23.67 27.41,22.3 IC4.38 | v32.21,26.64 41.28,26.64 IC1.20
  Route2 0.152: v32.21,26.64 28.55,26.64 v26.49,24.59
  Route15 0.152: v26.49,24.59 26.49,4.01 27.94,2.57 TTL_SERIAL.3
PC_TX2  (via drill 0.35)
  Top 0.152: v18.57,11.18 21.01,11.18 21.92,12.09 21.92,17.73 21.61,18.03 21.01,18.03 IC4.4 | IC1.1 41.28,16.97 42.11,17.81 43.03,17.81 43.1,17.73 43.1,15.44 41.73,14.07 40.67,14.07 35.03,8.43 33.58,8.43 32.36,7.21 v30.68,7.21
  Route2 0.152: v30.68,7.21 30.07,7.21 TTL_SERIAL.2
  Route15 0.152: v18.57,11.18 18.57,9.35 25.35,2.57 TTL_SERIAL.2
PGC  (via drill 0.35)
  Top 0.152: v34.8,10.95 32.59,10.95 31.44,12.09 26.57,12.09 25.88,11.4 25.88,10.79 IC4.16
  Route15 0.152: v34.8,10.95 34.8,11.79 37.01,14 37.01,30.46 34.8,32.66 34.8,39.9 | 34.8,39.9 34.8,42.72 30.53,46.99 EXT_IO.5 | 34.8,39.9 33.88,39.9 33.43,40.36 30.61,40.36 29.77,41.2 17.58,41.2 17.27,40.89 16.05,40.89 14,42.95 11.02,42.95 3.86,35.79 3.86,35.56 ICSP.5
PGD  (via drill 0.35)
  Top 0.152: v34.8,10.03 33.05,10.03 31.29,11.79 27.1,11.79 26.72,11.4 26.72,10.79 IC4.17 | v17.88,40.59 10.41,40.59 7.98,38.15 3.86,38.15 ICSP.4
  Route2 0.152: v17.88,40.59 21.54,40.59 EXT_IO.6
  Route15 0.152: v34.8,10.03 37.31,12.55 37.31,42.72 30.53,49.5 EXT_IO.6
POWERIN
  Top 0.305: GLORY.2 9.96,4.01 9.96,7.59 F1.1
R_RESET  (via drill 0.35)
  Top 0.152: v33.05,25.81 40.36,25.81 40.82,25.35 41.73,25.35 41.89,25.5 41.89,27.71 40.13,29.46 35.79,29.46 35.6,29.65 | 35.6,29.65 35.56,29.69 35.56,33.35 34.65,34.27 R5.1 | R_RESET.2 30.53,54.61 34.57,50.57 34.57,49.58 R6.1 34.57,49.5 33.12,48.06 33.12,30.23 33.88,29.46 35.41,29.46 35.6,29.65 | v31.98,56.44 31.6,56.82 6.3,56.82 3.1,53.62 3.1,53.39 RESET.1
  Bottom 0.152: v33.05,25.81 28.17,20.93 28.17,20.85 27.64,20.32 C1.1 | v31.98,56.44 31.67,56.13 31.6,56.13 30.53,55.07 30.53,54.61 R_RESET.2
RB5  (via drill 0.35)
  Top 0.152: v17.88,11.86 17.88,10.95 18.26,10.57 20.85,10.57 22.07,11.79 24.66,11.79 25.04,11.4 25.04,10.79 IC4.15
  Route2 0.152: v17.88,11.86 17.88,16.05 19.03,17.2 19.03,20.93 17.27,22.68 17.27,23.98 15.21,26.04 15.21,38.08 MISC_IO.6 20.78,39.37 23.82,42.42 26.87,42.42 28.85,44.4 30.46,44.4 EXT_IO.4
RD5  (via drill 0.35)
  Top 0.152: v18.19,23.52 19.33,23.52 21.92,20.93 21.92,19.33 21.54,18.95 21.01,18.95 IC4.3 | EXT_IO.2 19.18,39.37 16.66,36.86 16.51,36.86 MISC_IO.5
  Route2 0.152: v18.19,23.52 15.52,26.19 15.52,35.79 16.51,36.78 MISC_IO.5
RD7  (via drill 0.35)
  Top 0.152: v16.97,19.94 16.97,18.95 18.57,17.35 20.93,17.35 IC4.5
  Route2 0.152: v16.97,19.94 16.97,23.82 14.91,25.88 14.91,40.28 16.51,41.89 MISC_IO.7
  Route15 0.152: EXT_IO.3 30.46,41.89 28.55,41.89 28.4,41.73 16.66,41.73 16.51,41.89 MISC_IO.7
RE2
  Top 0.152: MISC_IO.3 24.59,31.75 31.44,24.89 31.44,24.28 31.37,24.21 31.37,16.13 31.75,15.75 32.36,15.75 IC4.27
RELAY  (via drill 0.35)
  Top 0.152: v22.45,32.66 25.27,32.66 39.52,18.42 39.52,16.51 36.7,13.69 36.09,13.69 35.71,14.07 32.44,14.07 IC4.25
  Route2 0.152: v22.45,32.66 16.51,26.72 MISC_IO.1
RLED  (via drill 0.35)
  Top 0.152: v12.55,10.34 15.52,13.31 IC4.10
  Route15 0.152: v12.55,10.34 9.2,6.98 v6.76,6.98
  Bottom 0.152: v6.76,6.98 6.98,6.98 7.14,6.83 7.44,6.83 7.9,6.38 R8.2
RS232_RX_IN
  Top 0.152: 64.82,43.18 62.53,43.18 58.95,46.76 58.95,46.99 B-NORM.1 | 64.82,43.18 64.82,16.51 PVP_0.4 | 64.82,43.18 A+REV.1
RS232_TX_OUT  (via drill 0.35)
  Top 0.152: B-REV.1 64.21,48.06 58.27,48.06 58.11,47.9 58.11,46.08 58.88,45.31 58.88,43.18 A+NORM.1 | 58.95,42.95 58.95,43.18 A+NORM.1 | v61.77,20.78 61.77,40.13 58.95,42.95 | 58.95,42.95 A+NORM.1
  Route2 0.152: v61.77,20.78 PVP_0.5
RS232EQRX
  Top 0.152: IC1.19 42.49,26.64 42.49,30.23 40.82,31.9 40.82,49.66 43.18,52.02 SV1.9
RS232EQTX
  Top 0.152: SV1.10 44.17,55.6 51.26,55.6 52.09,54.76 52.09,34.8 50.95,33.66 49.96,33.66 43.87,27.56 43.87,26.64 IC1.18
RS232RX  (via drill 0.35)
  Top 0.152: B-NORM.2 63.52,46.99 64.59,45.92 65.96,45.92 66.8,46.76 B-REV.2 66.8,47.22 65.66,48.36 58.11,48.36 52.4,42.65 52.4,34.65 45.62,27.86 44.63,27.86 44.4,27.64 44.4,25.5 43.83,24.93 | 49.39,34.76 44.93,39.22 44.93,39.83 43.87,40.89 41.96,40.89 41.12,41.73 41.12,45.08 43.03,46.99 SV1.7 | 49.39,34.76 49.43,34.72 50.04,34.72 51.26,35.94 51.26,38.3 51.3,38.34 48.59,41.05 v48.59,45.69 | IC1.4 45.08,23.67 43.83,24.93 | 43.83,24.93 43.26,25.5 43.26,28.63 49.39,34.76
  Bottom 0.152: v48.59,45.69 R16.2
RS232TX  (via drill 0.35)
  Top 0.152: SV1.8 43.18,49.5 44.93,47.75 48.67,47.75 50.49,45.92 v50.49,44.47 | IC1.5 46.38,16.59 46.38,17.04 47.6,18.26 51.41,18.26 52.02,17.65 52.02,15.52 52.25,15.29 53.24,15.29 58.11,20.17 62.08,20.17 62.38,20.47 62.38,41.28 60.48,43.18 A+NORM.2 60.4,43.18 60.4,43.48 59.49,44.4 v59.49,44.55 | A+REV.2 66.8,43.41 65.66,44.55 v62.08,44.55
  Route2 0.152: v59.49,44.55 v62.08,44.55
  Route15 0.152: v50.49,44.47 51.33,44.47 51.49,44.32 59.26,44.32 v59.49,44.55
  Bottom 0.152: v50.49,44.47 50.49,43.18 R13.1
SCK1  (via drill 0.35)
  Top 0.152: 26.07,27.67 22.99,30.76 14.99,30.76 11.48,34.27 DIGITAL.4 | 26.07,27.67 26.11,27.64 26.11,25.58 26.49,25.2 26.8,25.2 28.25,23.75 28.25,22.3 IC4.37 | v27.71,27.71 26.11,27.71 26.07,27.67
  Route2 0.152: v27.71,27.71 35.33,35.33 44.4,35.33 48.82,39.75 50.11,39.75 63.45,53.09 63.45,54.61 DISPLAY.3
SDI1
  Top 0.152: IC4.42 24.21,22.3 24.21,26.8 22.83,28.17 10.26,28.17 9.65,28.78 9.65,35.03 11.4,36.78 DIGITAL.5
SDO1  (via drill 0.35)
  Top 0.152: v9.5,36.17 9.35,36.02 9.35,28.63 10.11,27.86 22.68,27.86 23.44,27.1 23.44,22.3 IC4.43 | v32.89,55.6 33.66,56.36 58.88,56.36 60.63,54.61 DISPLAY.4
  Route2 0.152: v9.5,36.17 9.5,37.47 11.4,39.37 DIGITAL.6 11.48,39.37 15.06,42.95 20.24,42.95 v32.89,55.6
UC_RX  (via drill 0.35)
  Top 0.152: v7.06,33.73 7.06,28.85 15.37,20.55 20.93,20.55 IC4.1
  Route2 0.152: v7.06,33.73 7.06,45.16 DIGITAL.10
UC_TX  (via drill 0.35)
  Top 0.152: v22.68,26.95 22.68,22.3 IC4.44
  Route15 0.152: v22.68,26.95 22.68,31.52 17.5,36.7 17.5,37.31 16.43,38.38 14.99,38.38 11.48,41.89 DIGITAL.7
VCC  (via drill 0.35)
  Top 0.305: v24.82,6.07 39.14,6.07 39.6,6.53 52.55,6.53 53.62,7.59 C10.1 53.62,7.75 51.94,9.42 v51.94,12.09 | IC1.7 48.89,15.14 v50.95,13.08
  Route2 0.305: v15.6,5 15.67,4.93 23.67,4.93 v24.82,6.07 | v51.94,12.09 v50.95,13.08
  Bottom 0.305: C2.1 47.9,21.54 47.9,19.1 C9.1 48.06,18.95 48.36,18.64 48.74,18.64 49.58,17.81 51.1,17.81 R17.2 51.1,17.65 51.1,13.23 v50.95,13.08 | v15.6,5 14.99,5.61 14.99,6.3 R19.1
VDD  (via drill 0.35)
  Top 0.305: IC4.28 34.19,16.51 v36.4,14.3 | TTL_SERIAL.4 30.53,2.57 31.75,3.79 v35.79,3.79 35.86,3.71 39.37,3.71 40.74,2.34 52.17,2.34 56.52,6.68 56.52,13.92 | v39.67,5.08 R14.1 | OS1_16MHZ.1 62.23,6.6 63.75,8.13 63.75,8.89 v63.68,8.97 63.37,9.27 62.61,9.27 62.23,9.65 OS1_16MHZ.4 62.23,13.92 | 66.27,13.92 68.78,13.92 72.06,10.64 72.06,10.18 C4.1 | 66.27,13.92 62.23,13.92 | 62.23,13.92 56.52,13.92 | 56.52,13.92 53.09,13.92 | 53.09,13.92 52.78,13.92 51.26,12.39 51.26,8.74 50.34,7.82 42.04,7.82 R3.2 | v9.96,19.41 10.18,19.63 12.62,19.63 16.51,15.75 20.93,15.75 IC4.7 | F1.2 7.82,7.67 7.37,7.67 4.7,10.34 2.57,10.34 1.96,10.95 1.96,19.71 3.79,21.54 ANALOG.8 3.71,21.69 3.71,21.92 1.65,23.98 1.65,41.05 3.71,43.1 ICSP.2 10.18,43.18 11.4,44.4 DIGITAL.8 11.48,44.55 13.77,46.84 13.77,55.45 14.76,56.44 18.26,56.44 20.09,54.61 SV2.5 20.4,54.69 20.63,54.69 22.38,56.44 30.99,56.44 37.31,50.11 | C13.1 34.57,30.53 34.57,32.44 33.5,33.5 33.5,40.82 36.78,44.09 ZENER.C 36.78,44.25 36.55,44.47 36.55,49.5 R6.2 36.7,49.5 37.31,50.11 | 41.35,53.16 40.36,53.16 37.31,50.11 | 41.35,53.16 41.35,55.07 42.27,55.98 51.49,55.98 52.78,54.69 55.75,54.69 DISPLAY.6 55.91,54.61 57.73,52.78 62.84,52.78 67.72,47.9 67.72,42.27 67.03,41.58 67.03,24.97 67.11,24.89 67.11,18.64 66.27,17.81 66.27,13.92 | v50.49,52.7 44.86,52.7 44.4,53.16 41.35,53.16 | 53.09,13.92 v53.09,13.46
  Route2 0.305: v39.67,5.08 37.08,5.08 v35.79,3.79 | v9.96,19.41 5.99,19.41 ANALOG.8
  Route15 0.305: TTL_SERIAL.4 30,3.02 v30,8.43 35.86,14.3 v36.4,14.3
  Bottom 0.305: v36.4,14.3 37.77,12.93 C3.1 | v30,8.43 27.64,10.79 27.64,16.51 C11.1 | v35.79,3.79 36.47,4.47 36.47,5.08 C12.1 | v63.68,8.97 64.59,8.97 65.66,7.9 65.66,7.67 C5.1 | C6.1 50.49,50.8 v50.49,52.7 50.49,54.61 R1.2 | v53.09,13.46 53.09,17.58 R17.1
VREF  (via drill 0.35)
  Top 0.152: v27.1,7.29 29.77,7.29 30.61,8.13 30.61,10.72 IC4.22
  Route2 0.152: v27.1,7.29 26.95,7.29 24.05,4.39 12.17,4.39 10.57,2.79 3.4,2.79 2.79,3.4 2.79,7.9 3.79,8.89 ANALOG.3
VSS  (via drill 0.35)
  Top 0.305: LED3.C 7.9,12.7 v7.9,14 7.9,15.21 LED2.C 7.9,15.37 7.9,17.73 LED1.C 7.9,17.88 7.9,18.34 9.65,20.09 12.85,20.09 16.43,16.51 IC4.6 | C13.2 36.55,30.53 v36.55,31.83 36.55,32.44 37.47,33.35 37.47,39.06 36.86,39.67 ZENER.A | v34.8,17.35 32.44,17.35 IC4.29 | v50.42,5.08 R15.2 | RESET.2 4.62,53.39 8.89,53.39 10.11,54.61 SV2.1 | v50.42,8.89 R4.1
  other vias: 59.69,10.16 59.69,7.62 59.69,5.08 68.58,7.62 62.23,7.62
  pour Bottom (no thermals): 1.27,57.15 77.47,57.15 77.47,1.27 1.27,1.27
  pour Top (no thermals): 58.42,11.43 69.85,11.43 69.85,3.81 58.42,3.81

### Text on the board
Top: SECS/GEM Q84 V1.1